# EAGLE design usblipocharger (EAGLE 5.04)
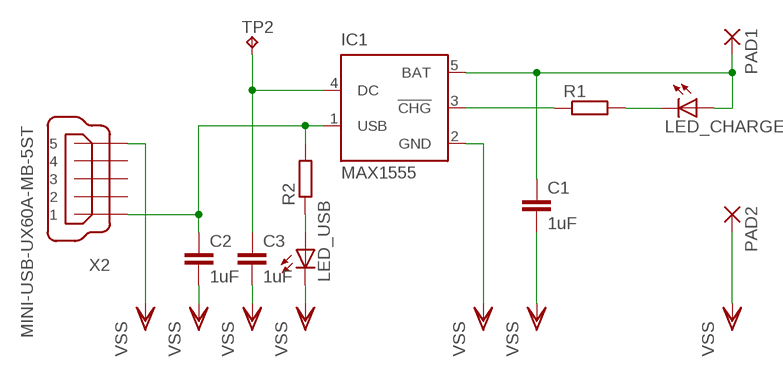
[diagram p0: schematic, sheet 1]

## Parts
C1  1uF  C-EUC0805  [C0805]
C2  1uF  C-EUC0805  [C0805]
C3  1uF  C-EUC0805  [C0805]
IC1  MAX1555  [SOT23-5L]
LED_CHARGE  LEDCHIP-LED0805  [CHIP-LED0805]
LED_USB  LEDCHIP-LED0805  [CHIP-LED0805]
PAD1  2,54/0,8  [2,54/0,8]
PAD2  2,54/0,8  [2,54/0,8]
R1  R-EU_R0805  [R0805]
R2  R-EU_R0805  [R0805]
TP2  TPB1,27  [B1,27]
X2  MINI-USB-UX60A-MB-5ST  [UX60A-MB-5ST]

## Nets
N$1: LED_USB.A R2.1
N$2: C2.1 IC1.1(USB) R2.2 X2.1
N$3: C3.1 IC1.4(DC) TP2.PP(TP)
N$6: IC1.3(!CHG) R1.1
N$7: LED_CHARGE.C R1.2
N$8: C1.1 IC1.5(BAT) LED_CHARGE.A PAD1.1(P)
VSS: C1.2 C2.2 C3.2 IC1.2(GND) LED_USB.C PAD2.1(P) X2.5
Unconnected: X2.2 X2.3 X2.4

## Library data of the parts
C1-C3 = rcl:C-EU: CAPACITOR, European symbol
IC1 = maxim:MAX1555: Dual-Input USB/AC Adapter 1-Cell Li+ Battery Chargers Source: http://www.maxim-ic.com .. MAX1551-MAX1555.pdf
LED_CHARGE LED_USB = led:LED: LED OSRAM: - CHIPLED LG R971, LG N971, LY N971, LG Q971, LY Q971, LO R971, LY R971 LH N974, LH R974 LS Q976, LO Q976, LY Q976 LO Q996 - Hyper CHIPLED LW Q18S LB Q993, LB Q99A, LB R99A - SideLED LS A670, LO A670, LY A670, LG A670, LP A670 LB A673, LV A673, LT A673, LW A673 LH A674 LY A675 LS A676, LA A676, LO A676, LY A676, LW A676 LS A679, LY A679, LG A679 - Hyper Micro SIDELED® LS Y876, LA Y876, LO Y876, LY Y876 LT Y87S - SmartLED LW L88C, LW L88S LB L89C, LB L89S, LG L890 LS L89K, LO L89K, LY L89K LS L896, LA L896, LO L896, LY L896 - TOPLED LS T670, LO T670, LY T670, LG T670, LP T670 LSG T670, LSP T670, LSY T670, LOP T670, LYG T670 LG T671, LOG T671, LSG T671 LB T673, LV T673, LT T673, LW T673 LH T674 LS T676, LA T676, LO T676, LY T676, LB T676, LH T676, LSB T676, LW T676 LB T67C, LV T67C, LT T67C, LS T67K, LO T67K, LY T67K, LW E67C LS E67B, LA E67B, LO E67B, LY E67B, LB E67C, LV E67C, LT E67C LW T67C LS T679, LY T679, LG T679 LS T770, LO T770, LY T770, LG T770, LP T770 LB T773, LV T773, LT T773, LW T773 LH T774 LS E675, LA E675, LY E675, LS T675 LS T776, LA T776, LO T776, LY T776, LB T776 LHGB T686 LT T68C, LB T68C - Hyper Mini TOPLED® LB M676 - Mini TOPLED Santana® LG M470 LS M47K, LO M47K, LY M47K Source: http://www.osram.convergy.de LUXEON: - LUMILED® LXK2-PW12-R00, LXK2-PW12-S00, LXK2-PW14-U00, LXK2-PW14-V00 LXK2-PM12-R00, LXK2-PM12-S00, LXK2-PM14-U00 LXK2-PE12-Q00, LXK2-PE12-R00, LXK2-PE12-S00, LXK2-PE14-T00, LXK2-PE14-U00 LXK2-PB12-K00, LXK2-PB12-L00, LXK2-PB12-M00, LXK2-PB14-N00, LXK2-PB14-P00, LXK2-PB14-Q00 LXK2-PR12-L00, LXK2-PR12-M00, LXK2-PR14-Q00, LXK2-PR14-R00 LXK2-PD12-Q00, LXK2-PD12-R00, LXK2-PD12-S00 LXK2-PH12-R00, LXK2-PH12-S00 LXK2-PL12-P00, LXK2-PL12-Q00, LXK2-PL12-R00 Source: www.luxeon.com KINGBRIGHT: KA-3528ASYC Source: www.kingbright.com
PAD1 PAD2 = wirepad:2,54/0,8: THROUGH-HOLE PAD
R1 R2 = rcl:R-EU_: RESISTOR, European symbol
TP2 = testpad:TP: Test pad
X2 = con-hirose:MINI-USB-: MINI USB Connector Source: http://www.hirose.co.jp/cataloge_hp/e24000019.pdf

## Board
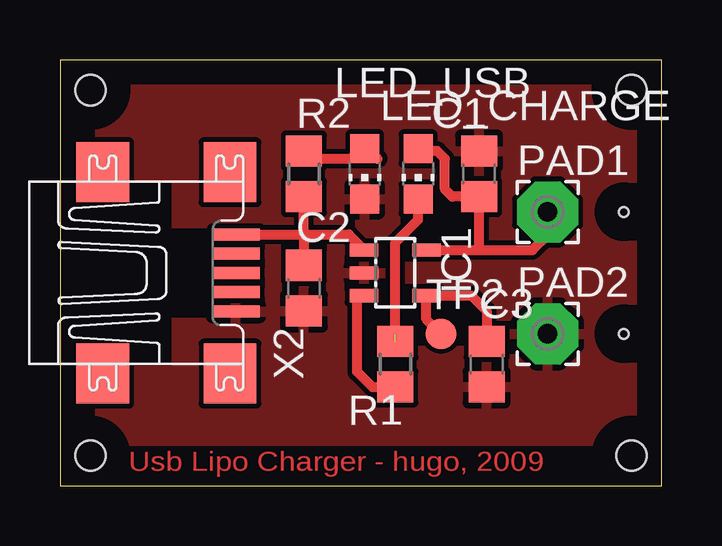
[diagram p1: board, top side]

Size 25.07 x 17.77 mm. Coordinates in mm from the lower left corner, seen from the top.
Outline: 0,0 25.07,0 25.07,17.77 0,17.77 0,0
Copper layers (1*16): Top 0.035mm / dielectric 1.5mm / Bottom 0.035mm
Design rules "default": minimum track width 10mil, minimum drill 24mil, track to track 8mil, track to pad 8mil, pad to pad 8mil, via to via 8mil, smd to smd 8mil, copper to edge 40mil, drill to drill 8mil, minimum pad ring 10mil, minimum via ring 8mil, stop-mask expansion 4mil, vias tented up to drill 0mil, thermal gap 10mil
Holes 1.27 mm at 1.27,16.51 1.27,1.27 23.81,1.27 23.81,16.51
Holes 0.4 mm at 23.5,11.43 23.5,6.35

### Footprints (pad centres in the part's own frame; a part is rotated, then mirrored left to right if it is on the bottom)
C0805 = smd 1.3 x 1.5: 1 -0.95,0; 2 0.95,0
SOT23-5L = smd 0.55 x 1.2: 1 -0.95,-1.3; 2 0,-1.3; 3 0.95,-1.3; 4 0.95,1.3; 5 -0.95,1.3
CHIP-LED0805 = smd 1.2 x 1.2: A 0,-1.05; C 0,1.05
2,54/0,8 = drill 0.813 pad 2.54 octagon: 1 0,0
R0805 = smd 1.3 x 1.5: 1 -0.95,0; 2 0.95,0
B1,27 = smd 1.27 x 1.27: PP 0,0
UX60A-MB-5ST = smd 2 x 0.5: 1 2.25,1.6; 2 2.25,0.8; 3 2.25,0; 4 2.25,-0.8; 5 2.25,-1.6 | smd 2.2 x 2.5: M1 -3.3,-4.2; M2 -3.3,4.2; M3 2,4.2; M4 2,-4.2

### Placement (x,y rotation side)
C1  17.46,13.02 90 top
C2  10.16,8.26 270 top
C3  17.78,5.08 270 top
IC1  13.97,8.89 270 top
LED_CHARGE  14.92,13.02 180 top
LED_USB  12.7,13.02 180 top
PAD1  20.32,11.43 0 top
PAD2  20.32,6.35 0 top
R1  13.97,5.08 90 top
R2  10.16,13.02 270 top
TP2  15.88,6.35 0 top
X2  5.08,8.89 0 top

### Tracks (layer width: path | path; a pad name or v marks a point on that pad's centre or on a via)
N$1
  Top 0.406: 13.23,13.65 LED_USB.A 12.06,13.65 10.16,13.65 R2.1
N$2
  Top 0.406: 10.16,10.49 12.04,10.49 IC1.1 | 10.16,10.49 C2.1 | 10.16,10.49 R2.2 | X2.1 10.16,10.49
N$3
  Top 0.406: C3.1 17.78,7.3 17.14,7.94 IC1.4 15.27,6.96 TP2.PP
N$6
  Top 0.406: IC1.3 12.38,7.94 12.38,4.76 13.02,4.13 R1.1
N$7  (1 unrouted)
  Top 0.406: 13.97,6.35 13.97,10.16 14.92,11.11 LED_CHARGE.C
N$8
  Top 0.406: IC1.5 16.51,9.84 16.83,9.84 17.46,9.84 | 17.46,9.84 C1.1 16.35,12.06 16.03,12.38 16.03,13.65 15.72,13.97 14.92,13.97 LED_CHARGE.A | 17.46,9.84 19.68,9.84 20.32,10.48 PAD1.1
VSS
  pour Top: 0,17.78 25.08,17.78 25.08,0 0,0

### Text on the board
Top: Usb Lipo Charger - hugo, 2009